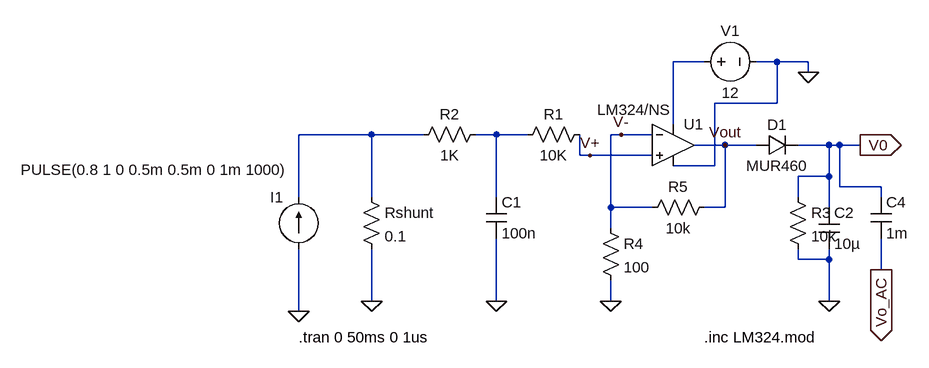
[diagram p0: schematic sensadocorriente.asc]
sensadocorriente.asc, the LTspice schematic file:
Version 4
SHEET 1 1268 680
WIRE 304 -32 256 -32
WIRE 416 -32 384 -32
WIRE 464 -32 416 -32
WIRE 464 -16 464 -32
WIRE 416 32 416 -32
WIRE 416 32 320 32
WIRE 256 64 256 -32
WIRE -208 80 -320 80
WIRE -128 80 -208 80
WIRE -16 80 -48 80
WIRE 32 80 -16 80
WIRE 176 80 160 80
WIRE 224 80 176 80
WIRE 336 96 288 96
WIRE 384 96 336 96
WIRE 496 96 448 96
WIRE 512 96 496 96
WIRE 544 96 512 96
WIRE 112 112 112 80
WIRE 128 112 112 112
WIRE 224 112 128 112
WIRE 320 128 320 32
WIRE 320 128 256 128
WIRE 496 144 496 96
WIRE 496 144 448 144
WIRE 512 160 512 96
WIRE 576 160 512 160
WIRE -320 176 -320 80
WIRE -208 176 -208 80
WIRE -16 176 -16 80
WIRE 448 176 448 144
WIRE 576 176 576 160
WIRE 160 192 160 80
WIRE 224 192 160 192
WIRE 336 192 336 96
WIRE 336 192 304 192
WIRE 496 192 496 144
WIRE 160 224 160 192
WIRE 448 272 448 256
WIRE 496 272 496 256
WIRE 496 272 448 272
WIRE 576 288 576 240
WIRE -208 336 -208 256
WIRE -16 336 -16 240
WIRE 160 336 160 304
WIRE 496 336 496 272
WIRE -320 352 -320 256
FLAG 160 336 0
FLAG -16 336 0
FLAG -208 336 0
FLAG 496 336 0
FLAG -320 352 0
FLAG 544 96 V0
IOPIN 544 96 Out
FLAG 464 -16 0
FLAG 128 112 V+
FLAG 176 80 V-
FLAG 336 96 Vout
FLAG 576 288 Vo_AC
IOPIN 576 288 Out
SYMBOL res 16 96 R270
WINDOW 0 32 56 VTop 2
WINDOW 3 0 56 VBottom 2
SYMATTR InstName R1
SYMATTR Value 10K
SYMBOL res -144 96 R270
WINDOW 0 32 56 VTop 2
WINDOW 3 0 56 VBottom 2
SYMATTR InstName R2
SYMATTR Value 1K
SYMBOL res -224 160 R0
SYMATTR InstName Rshunt
SYMATTR Value 0.1
SYMBOL res 144 208 R0
SYMATTR InstName R4
SYMATTR Value 100
SYMBOL res 320 176 R90
WINDOW 0 0 56 VBottom 2
WINDOW 3 32 56 VTop 2
SYMATTR InstName R5
SYMATTR Value 10k
SYMBOL diode 384 112 R270
WINDOW 0 32 32 VTop 2
WINDOW 3 0 32 VBottom 2
SYMATTR InstName D1
SYMATTR Value MUR460
SYMBOL cap -32 176 R0
SYMATTR InstName C1
SYMATTR Value 100n
SYMBOL current -320 256 R180
WINDOW 0 24 80 Left 2
WINDOW 3 16 122 Left 2
WINDOW 123 0 0 Left 2
WINDOW 39 0 0 Left 2
SYMATTR InstName I1
SYMATTR Value PULSE(0.8 1 0 0.5m 0.5m 0 1m 1000)
SYMBOL voltage 288 -32 R270
WINDOW 0 32 56 VTop 2
WINDOW 3 -32 56 VBottom 2
WINDOW 123 0 0 Left 2
WINDOW 39 0 0 Left 2
SYMATTR InstName V1
SYMATTR Value 12
SYMBOL cap 480 192 R0
SYMATTR InstName C2
SYMATTR Value 10µ
SYMBOL Opamps\\opamp2 256 32 R0
WINDOW 3 -117 10 Left 2
SYMATTR Value LM324/NS
SYMATTR InstName U1
SYMBOL res 432 160 R0
SYMATTR InstName R3
SYMATTR Value 10k
SYMBOL cap 560 176 R0
SYMATTR InstName C4
SYMATTR Value 1m
TEXT -320 392 Left 2 !.tran 0 50ms 0 1us
TEXT 304 392 Left 2 !.inc LM324.mod

The netlist it stands for:
* sensadocorriente.asc
R1 N003 V+ 10K
R2 N002 N003 1K
Rshunt N002 0 0.1
R4 V- 0 100
R5 Vout V- 10k
D1 Vout V0 MUR460
C1 N003 0 100n
I1 0 N002 PULSE(0.8 1 0 0.5m 0.5m 0 1m 1000)
V1 N001 0 12
C2 V0 0 10µ
XU1 V+ V- N001 0 Vout LM324/NS  ; pins In+ In- V+ V- OUT
R3 V0 0 10k
C4 V0 Vo_AC 1m
.model D D
.lib standard.dio
.tran 0 50ms 0 1us
.inc LM324.mod
.backanno
.end